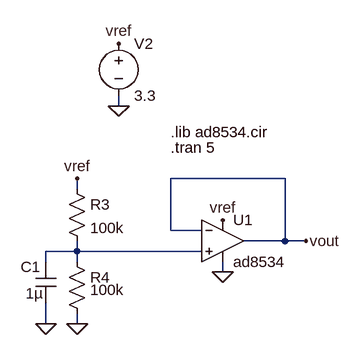
[diagram p0: schematic Referinta.asc]
Referinta.asc, the LTspice schematic file:
Version 4.1
SHEET 1 880 680
WIRE 64 48 64 32
WIRE 320 160 144 160
WIRE 0 176 0 160
WIRE 144 240 144 160
WIRE 192 240 144 240
WIRE 320 256 320 160
WIRE 320 256 256 256
WIRE 352 256 320 256
WIRE 0 272 0 256
WIRE 0 272 -48 272
WIRE 192 272 0 272
WIRE -48 288 -48 272
WIRE 0 288 0 272
WIRE 224 304 224 288
WIRE -48 384 -48 352
WIRE 0 384 0 368
FLAG 352 256 vout
FLAG 64 48 0
FLAG 64 -48 vref
FLAG 224 304 0
FLAG 224 224 vref
FLAG 0 160 vref
FLAG 0 384 0
FLAG -48 384 0
SYMBOL OpAmps\\opamp2 224 192 R0
SYMATTR InstName U1
SYMATTR Value ad8534
SYMBOL voltage 64 -64 R0
SYMATTR InstName V2
SYMATTR Value 3.3
SYMBOL res -16 160 R0
SYMATTR InstName R3
SYMATTR Value 100k
SYMBOL res -16 272 R0
WINDOW 3 36 59 Left 2
SYMATTR InstName R4
SYMATTR Value 100k
SYMBOL cap -32 352 R180
WINDOW 0 24 56 Left 2
WINDOW 3 20 15 Left 2
SYMATTR InstName C1
SYMATTR Value 1µ
TEXT 144 88 Left 2 !.lib ad8534.cir
TEXT 144 112 Left 2 !.tran 5

The netlist it stands for:
* Referinta.asc
X§U1 N001 vout vref 0 vout ad8534  ; pins In+ In- V+ V- OUT
V2 vref 0 3.3
R3 vref N001 100k
R4 N001 0 100k
C1 0 N001 1µ
.lib ad8534.cir
.tran 5
.backanno
.end